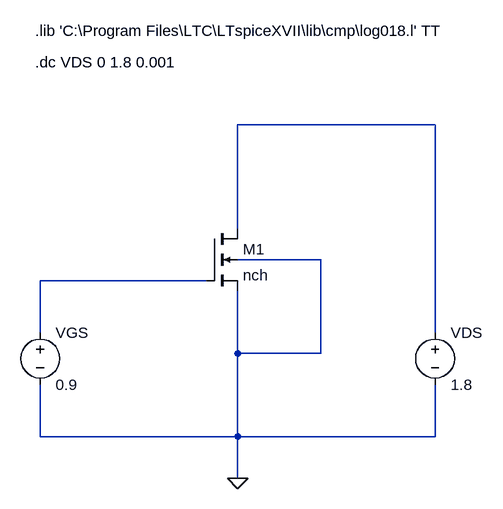
[diagram p0: schematic nmos-testbench.asc]
nmos-testbench.asc, the LTspice schematic file:
Version 4
SHEET 1 880 740
WIRE 256 128 -48 128
WIRE -48 288 -48 128
WIRE 80 336 -48 336
WIRE -96 368 -352 368
WIRE -352 448 -352 368
WIRE 256 448 256 128
WIRE -48 480 -48 384
WIRE 80 480 80 336
WIRE 80 480 -48 480
WIRE -352 608 -352 528
WIRE -48 608 -48 480
WIRE -48 608 -352 608
WIRE 256 608 256 528
WIRE 256 608 -48 608
WIRE -48 672 -48 608
FLAG -48 672 0
SYMBOL nmos4 -96 288 R0
SYMATTR InstName M1
SYMATTR Value nch
SYMATTR Value2 l=1u w=3u
SYMBOL voltage -352 432 R0
SYMATTR InstName VGS
SYMATTR Value 0.9
SYMBOL voltage 256 432 R0
WINDOW 123 0 0 Left 0
WINDOW 39 0 0 Left 0
SYMATTR InstName VDS
SYMATTR Value 1.8
TEXT -360 -16 Left 2 !.lib 'C:\\Program Files\\LTC\\LTspiceXVII\\lib\\cmp\\log018.l' TT
TEXT -360 32 Left 2 !.dc VDS 0 1.8 0.001

The netlist it stands for:
* nmos-testbench.asc
M1 N001 N002 0 0 nch l=1u w=3u
VGS N002 0 0.9
VDS N001 0 1.8
.model NMOS NMOS
.model PMOS PMOS
.lib standard.mos
.lib 'C:\Program Files\LTC\LTspiceXVII\lib\cmp\log018.l' TT
.dc VDS 0 1.8 0.001
.backanno
.end

* Results of the author's LTspice run, read from the files saved beside the schematic
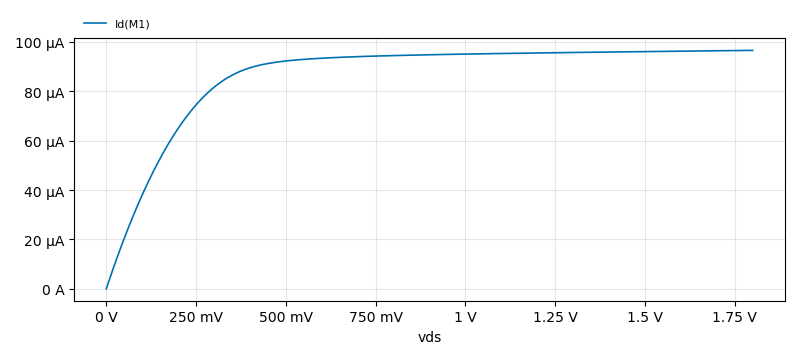
[diagram p1: DC transfer characteristic of nmos-testbench.asc, plotted from the saved traces]
* DC transfer characteristic, 1 run:
*   Id(M1): 0 A at vds=0 V, 96.54 µA at vds=1.8 V, min 0 A, max 96.54 µA